# Altium schematic sheet MCU.SchDoc
size A3
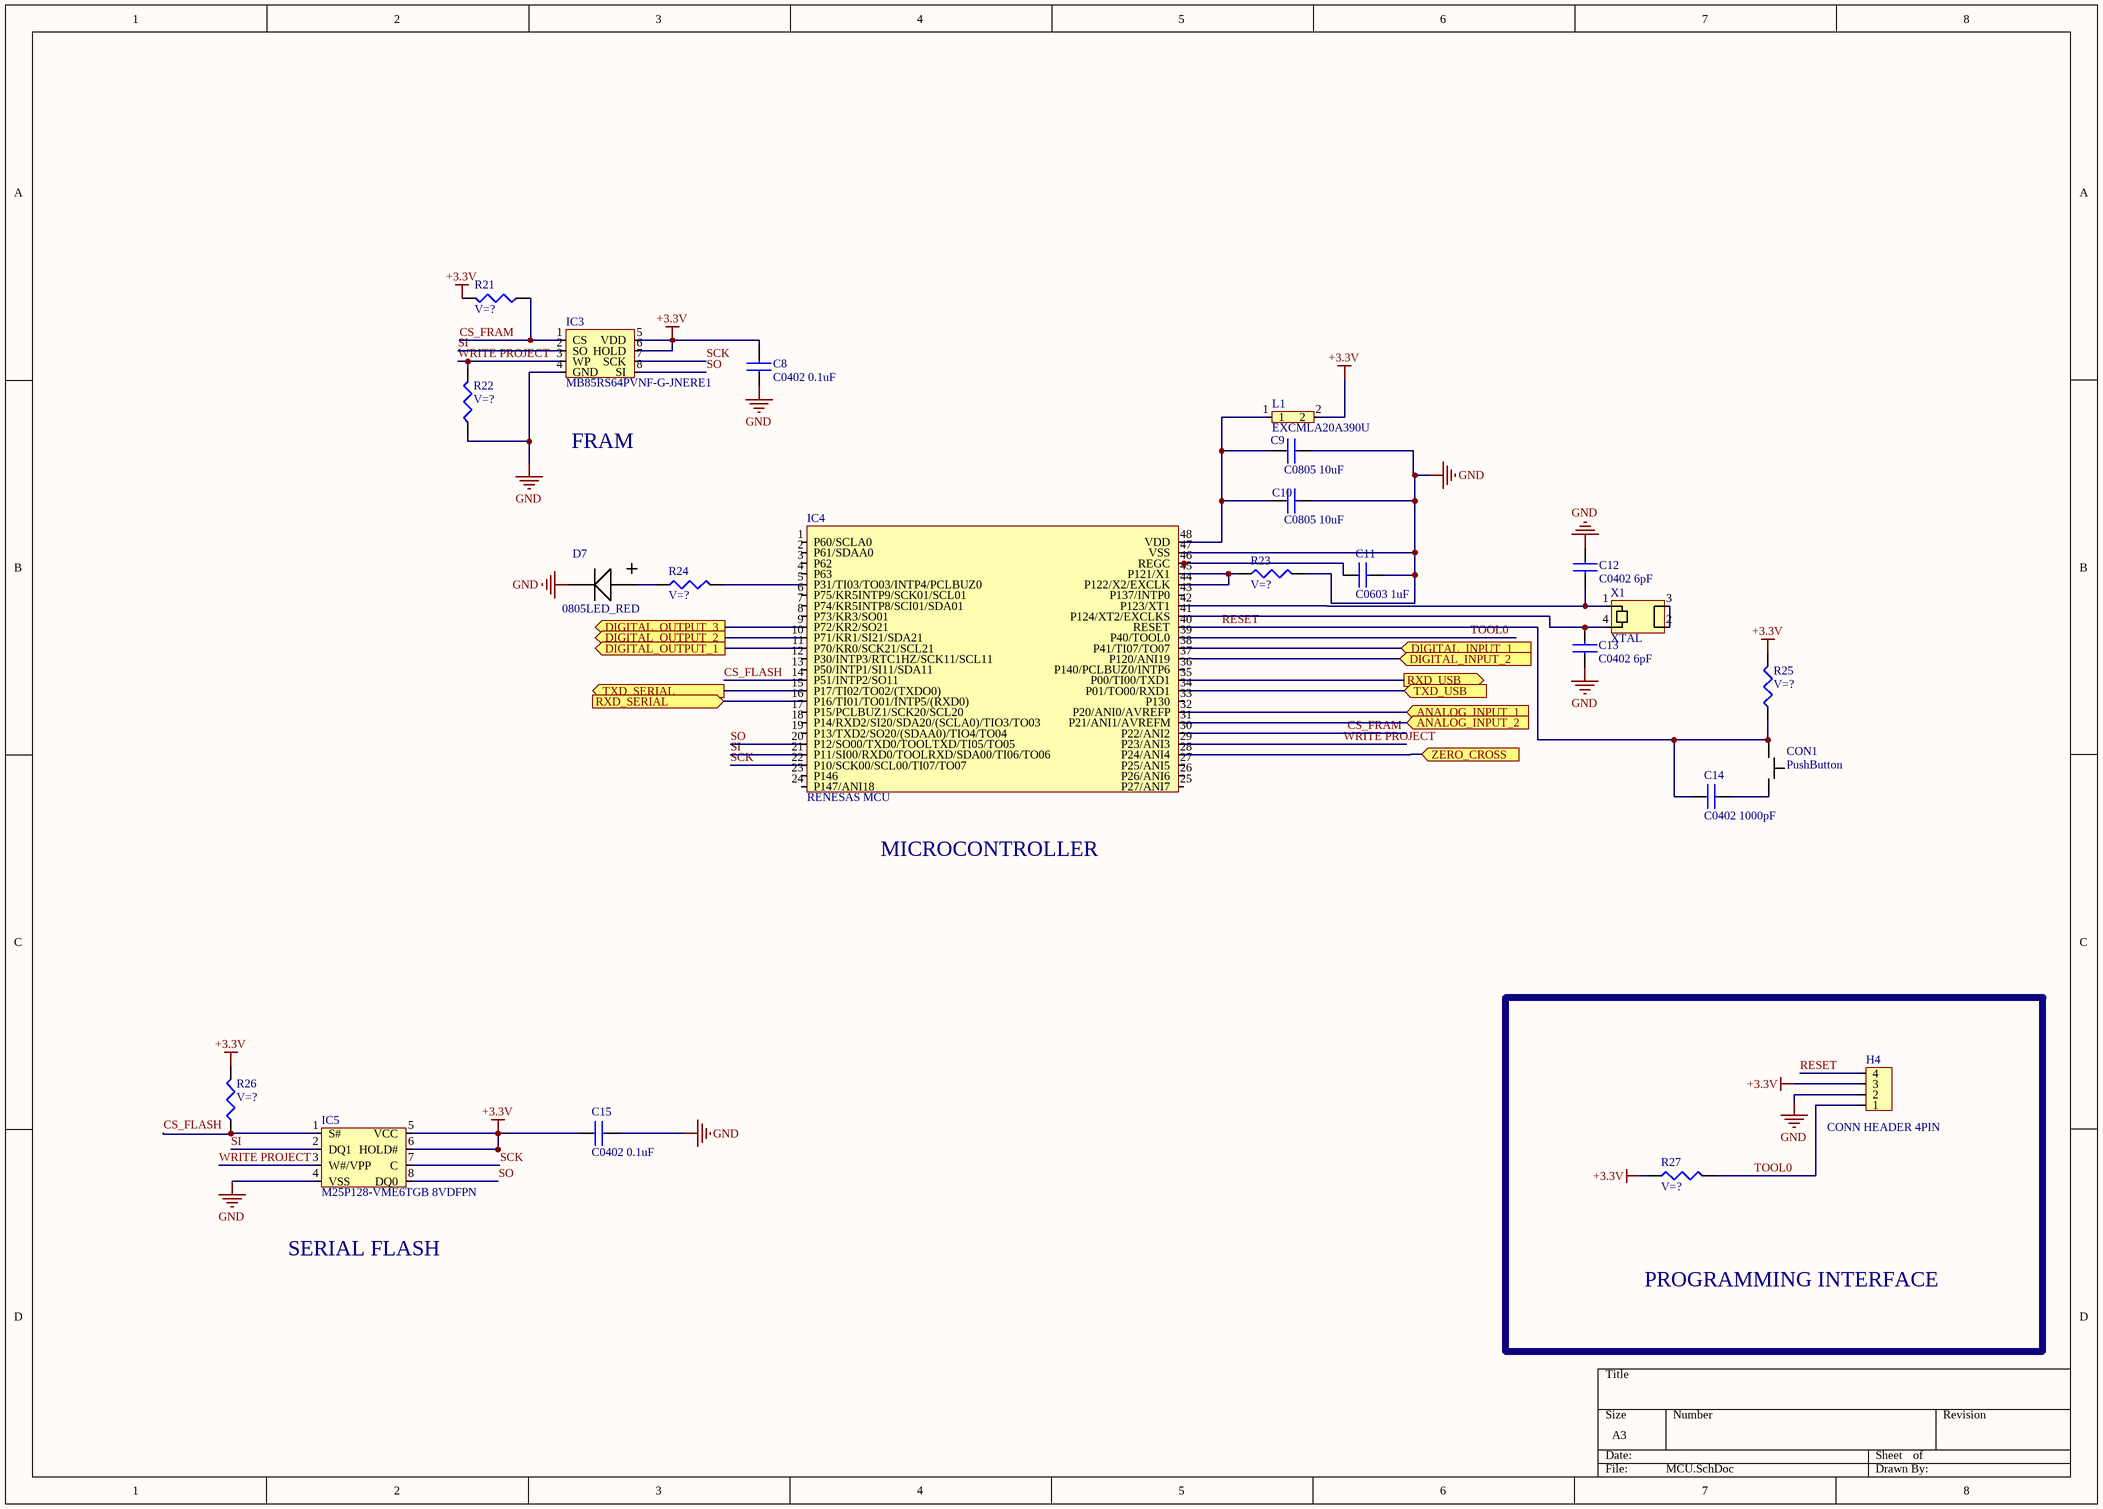
[diagram p0: MCU.SchDoc]

## Parts
C8  C0402 0.1uF  [C0402]
C9  C0805 10uF  [C0805]
C10  C0805 10uF  [C0805]
C11  C0603 1uF  [C0603]
C12  C0402 6pF  [C0402]
C13  C0402 6pF  [C0402]
C14  C0402 1000pF  [C0402]
C15  C0402 0.1uF  [C0402]
CON1  PushButton  [PUSHBUTTON]
D7  0805LED_RED  [0805LED_GREEN]
H4  CONN HEADER 4PIN  [CON HEADER 4PIN]
IC3  MB85RS64PVNF-G-JNERE1  [TSOP127P600X155-8N]
IC4  RENESAS MCU  [TSQFP50P900X900X160-48N]
IC5  M25P128-VME6TGB 8VDFPN  [QFN127P800X600X85_HS-9N]
L1  EXCMLA20A390U  [L0805]
R21  V=?  [r0402]
R22  V=?  [r0402]
R23  V=?  [r0402]
R24  V=?  [r0402]
R25  V=?  [r0402]
R26  V=?  [r0402]
R27  V=?  [r0402]
X1  XTAL  [XTAL]

## Blocks framed on the sheet
PROGRAMMING INTERFACE: H4 R27

## Ports
ANALOG_INPUT_1 (in), ANALOG_INPUT_2 (in), DIGITAL_INPUT_1 (in), DIGITAL_INPUT_2 (in), DIGITAL_OUTPUT_1 (out), DIGITAL_OUTPUT_2 (out), DIGITAL_OUTPUT_3 (out), RXD_SERIAL (in), RXD_USB (out), TXD_SERIAL (out), TXD_USB (in), ZERO_CROSS (in)

## Nets
+3.3V: C8.2 C15.1 H4.3 IC3.5(VDD) IC3.6(HOLD) IC5.5(VCC) IC5.6(HOLD#) L1.2 R21.2 R25.2 R26.2 R27.1
GND: C8.1 C9.2 C10.2 C11.2 C12.1 C13.1 C15.2 D7.1 H4.2 IC3.4(GND) IC4.47(VSS) IC5.4(VSS) R22.1 R23.2
ANALOG_INPUT_1: IC4.32(P20/ANI0/AVREFP) ; port ANALOG_INPUT_1
ANALOG_INPUT_2: IC4.31(P21/ANI1/AVREFM) ; port ANALOG_INPUT_2
CS_FLASH: IC4.14(P51/INTP2/SO11) IC5.1(S#) R26.1
CS_FRAM: IC3.1(CS) IC4.30(P22/ANI2) R21.1
DIGITAL_INPUT_1: IC4.38(P41/TI07/TO07) ; port DIGITAL_INPUT_1
DIGITAL_INPUT_2: IC4.37(P120/ANI19) ; port DIGITAL_INPUT_2
DIGITAL_OUTPUT_1: IC4.11(P70/KR0/SCK21/SCL21) ; port DIGITAL_OUTPUT_1
DIGITAL_OUTPUT_2: IC4.10(P71/KR1/SI21/SDA21) ; port DIGITAL_OUTPUT_2
DIGITAL_OUTPUT_3: IC4.9(P72/KR2/SO21) ; port DIGITAL_OUTPUT_3
RESET: C14.1 CON1.1 H4.4 IC4.40(RESET) R25.1
RXD_SERIAL: IC4.16(P16/TI01/TO01/INTP5/(RXD0)) ; port RXD_SERIAL
RXD_USB: IC4.35(P00/TI00/TXD1) ; port RXD_USB
SCK: IC3.7(SCK) IC4.22(P10/SCK00/SCL00/TI07/TO07) IC5.7(C)
SI: IC3.2(SO) IC4.21(P11/SI00/RXD0/TOOLRXD/SDA00/TI06/TO06) IC5.2(DQ1)
SO: IC3.8(SI) IC4.20(P12/SO00/TXD0/TOOLTXD/TI05/TO05) IC5.8(DQ0)
TOOL0: H4.1 IC4.39(P40/TOOL0) R27.2
TXD_SERIAL: IC4.15(P17/TI02/TO02/(TXDO0)) ; port TXD_SERIAL
TXD_USB: IC4.34(P01/TO00/RXD1) ; port TXD_USB
WRITE PROJECT: IC3.3(WP) IC4.29(P23/ANI3) IC5.3(W#/VPP) R22.2
ZERO_CROSS: IC4.28(P24/ANI4) ; port ZERO_CROSS
NetC9_1: C9.1 C10.1 IC4.48(VDD) L1.1
NetC11_1: C11.1 IC4.46(REGC)
NetC12_2: C12.2 IC4.42(P123/XT1) X1.1
NetC13_2: C13.2 IC4.41(P124/XT2/EXCLKS) X1.4
NetC14_2: C14.2 CON1.2
NetD7_2: D7.2 R24.1
NetIC4_5: IC4.5(P31/TI03/TO03/INTP4/PCLBUZ0) R24.2
NetIC4_44: IC4.44(P122/X2/EXCLK) IC4.45(P121/X1) R23.1
NetX1_2: X1.2 X1.3

Not connected (* = marked no-connect by the designer): IC4 1(P60/SCLA0) 2(P61/SDAA0) 3(P62) 4(P63) 6(P75/KR5INTP9/SCK01/SCL01) 7(P74/KR5INTP8/SCI01/SDA01) 8(P73/KR3/SO01) 12(P30/INTP3/RTC1HZ/SCK11/SCL11) 13(P50/INTP1/SI11/SDA11) 17(P15/PCLBUZ1/SCK20/SCL20) 18(P14/RXD2/SI20/SDA20/(SCLA0)/TIO3/TO03) 19(P13/TXD2/SO20/(SDAA0)/TIO4/TO04) 23(P146) 24(P147/ANI18) 25(P27/ANI7) 26(P26/ANI6) 27(P25/ANI5) 33(P130) 36(P140/PCLBUZ0/INTP6) 43(P137/INTP0)

## Notes on the sheet
- FRAM
- (near IC4) MICROCONTROLLER
- SERIAL FLASH

## Library data of the parts
C8 C15 = C0402 0.1uF: CAP CER 0.1uF 16V X7R 0402 / SAMSUNG
C9 C10 = C0805 10uF: CAP CER 10uF 6.3V X7R 0805 / C0805C106K9RACTU
C11 = C0603 1uF: CAP CER 1uF 10V X7R 0603
C12 C13 = C0402 6pF: CAP CER 6pF 100V C0G/NP0 0402 / KEMET
C14 = C0402 1000pF: CAP CER 1000pF 26V X7R 0402 / CL05B102KA5NNNC
CON1 = PushButton: SKPDACD010
D7 = 0805LED_RED: LSR976
H4 = CONN HEADER 4PIN: B4B-XHALFSN
IC3 = MB85RS64PVNF-G-JNERE1: IC FRAM 64K SPI 20MHZ 8SOP
IC4 = RENESAS MCU: IC MCU 16BIT 32KB FLASH 48LQFP
IC5 = M25P128-VME6TGB 8VDFPN: IC FLASH 128M SPI 54MHZ 9VDFPN
L1 = EXCMLA20A390U: FERRITE BEAD 39 OHM
R21-R27 = R0402: RESISTOR
X1 = XTAL: SSP-T7-F